# EAGLE design tiny84standalone (EAGLE 6.5.0)
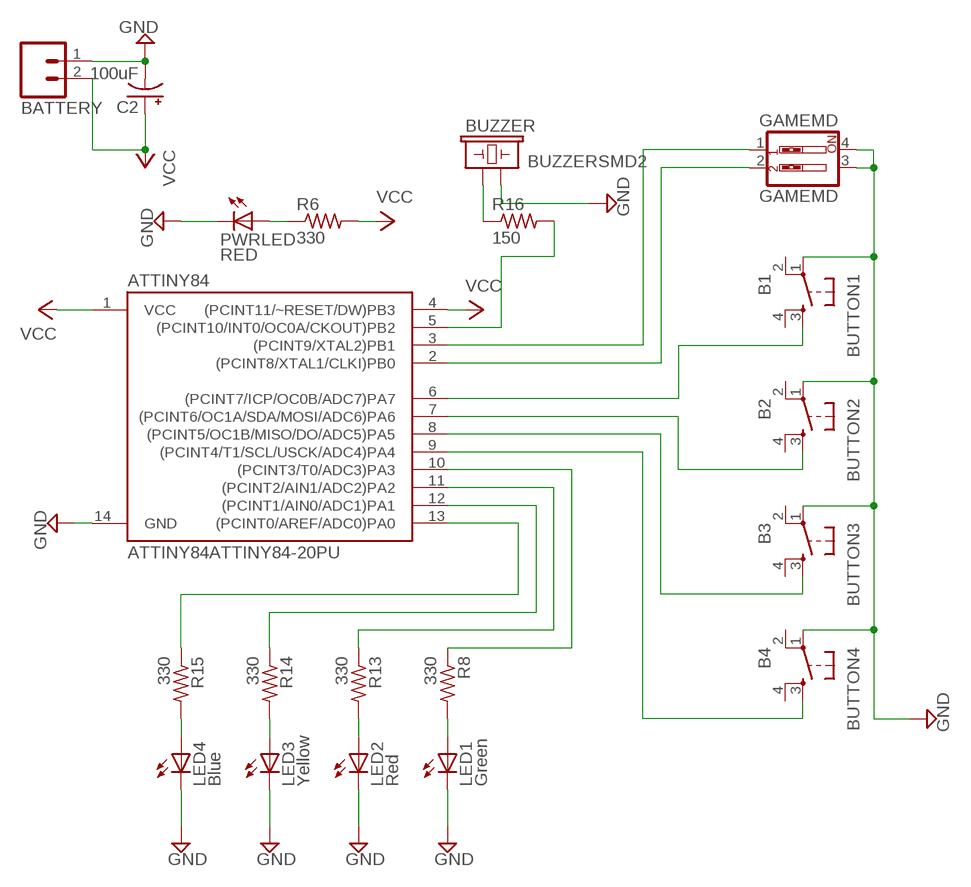
[diagram p0: schematic, sheet 1]

## Parts
ATTINY84  ATTINY84ATTINY84-20PU  [DIL14]
BATTERY  M02JST-PTH-VERT  [JST-2-PTH-VERT]
BUTTON1  B1  TAC_SWITCHPTH  [TACTILE-PTH]
BUTTON2  B2  TAC_SWITCHPTH  [TACTILE-PTH]
BUTTON3  B3  TAC_SWITCHPTH  [TACTILE-PTH]
BUTTON4  B4  TAC_SWITCHPTH  [TACTILE-PTH]
BUZZER  BUZZERSMD2  [BUZZER-CCV]
C2  100uF  CAP_POLPTH1  [CPOL-RADIAL-100UF-25V]
GAMEMD  GAMEMD  SW_DIP-2  [DIPSWITCH-02]
LED1  Green  LED5MM  [LED5MM]
LED2  Red  LED5MM  [LED5MM]
LED3  Yellow  LED5MM  [LED5MM]
LED4  Blue  LED5MM  [LED5MM]
PWRLED  RED  LEDCHIPLED_0805  [CHIPLED_0805]
R6  330  R-US_R0805  [R0805]
R8  330  R-US_R0805  [R0805]
R13  330  R-US_R0805  [R0805]
R14  330  R-US_R0805  [R0805]
R15  330  R-US_R0805  [R0805]
R16  150  R-US_R0805  [R0805]

## Nets
GND: ATTINY84.14(GND) BATTERY.1 BUTTON1.1 BUTTON2.1 BUTTON3.1 BUTTON4.1 BUZZER.- C2.2(-) GAMEMD.3 GAMEMD.4 LED1.K(C) LED2.K(C) LED3.K(C) LED4.K(C) PWRLED.C
N$1: BUZZER.+ R16.1
N$2: PWRLED.A R6.1
N$3: LED1.A R8.2
N$4: LED2.A R13.2
N$5: ATTINY84.6((PCINT7/ICP/OC0B/ADC7)PA7) BUTTON1.3
N$6: ATTINY84.5((PCINT10/INT0/OC0A/CKOUT)PB2) R16.2
N$7: LED3.A R14.2
N$8: LED4.A R15.2
N$9: ATTINY84.7((PCINT6/OC1A/SDA/MOSI/ADC6)PA6) BUTTON2.3
N$10: ATTINY84.3((PCINT9/XTAL2)PB1) GAMEMD.1
N$11: ATTINY84.2((PCINT8/XTAL1/CLKI)PB0) GAMEMD.2
N$13: ATTINY84.8((PCINT5/OC1B/MISO/DO/ADC5)PA5) BUTTON3.3
N$14: ATTINY84.9((PCINT4/T1/SCL/USCK/ADC4)PA4) BUTTON4.3
N$15: ATTINY84.10((PCINT3/T0/ADC3)PA3) R8.1
N$16: ATTINY84.11((PCINT2/AIN1/ADC2)PA2) R13.1
N$17: ATTINY84.12((PCINT1/AIN0/ADC1)PA1) R14.1
N$18: ATTINY84.13((PCINT0/AREF/ADC0)PA0) R15.1
VCC: ATTINY84.1(VCC) ATTINY84.4((PCINT11/~RESET/DW)PB3) BATTERY.2 C2.1(+) R6.2
Unconnected: BUTTON1.2 BUTTON1.4 BUTTON2.2 BUTTON2.4 BUTTON3.2 BUTTON3.4 BUTTON4.2 BUTTON4.4

## Library data of the parts
ATTINY84 = SparkFun-DigitalIC:ATTINY84: Atmel 14-pin 2/4/8kB flash uC
BATTERY = SparkFun-Connectors:M02: Standard 2-pin 0.1" header. Use with - straight break away headers ( PRT-00116) - right angle break away headers (PRT-00553) - swiss pins (PRT-00743) - machine pins (PRT-00117) - female headers (PRT-00115) Molex polarized connector foot print use with: PRT-08233 with associated crimp pins and housings. 2.54_SCREWTERM for use with PRT-10571. 3.5mm Screw Terminal footprints for PRT-08084 5mm Screw Terminal footprints for use with PRT-08433
BUTTON1-BUTTON4 = SparkFun-Electromechanical:TAC_SWITCH: Momentary Switch Button commonly used for reset or general input. Spark Fun Electronics SKU : COM-00097 SMT- SWCH-08247
BUZZER = SparkFun-Electromechanical:BUZZER: Buzzer 12mm Spark Fun Electronics SKU : Comp-Buzzer
C2 = SparkFun-Capacitors:CAP_POL: Capacitor Polarized These are standard SMD and PTH capacitors. Normally 10uF, 47uF, and 100uF in electrolytic and tantalum varieties. Always verify the external diameter of the through hole cap, it varies with capacity, voltage, and manufacturer. The EIA devices should be standard.
GAMEMD = SparkFun-Electromechanical:SW_DIP-2: DIP SWITCH
LED1-LED4 = SparkFun-LED:LED: LEDs Standard schematic elements and footprints for 5mm, 3mm, 1206, and 0603 sized LEDs. 5mm - Spark Fun Electronics SKU : COM-00529 (and others)
PWRLED = led:LED: LED OSRAM: - CHIPLED LG R971, LG N971, LY N971, LG Q971, LY Q971, LO R971, LY R971 LH N974, LH R974 LS Q976, LO Q976, LY Q976 LO Q996 - Hyper CHIPLED LW Q18S LB Q993, LB Q99A, LB R99A - SideLED LS A670, LO A670, LY A670, LG A670, LP A670 LB A673, LV A673, LT A673, LW A673 LH A674 LY A675 LS A676, LA A676, LO A676, LY A676, LW A676 LS A679, LY A679, LG A679 - Hyper Micro SIDELED® LS Y876, LA Y876, LO Y876, LY Y876 LT Y87S - SmartLED LW L88C, LW L88S LB L89C, LB L89S, LG L890 LS L89K, LO L89K, LY L89K LS L896, LA L896, LO L896, LY L896 - TOPLED LS T670, LO T670, LY T670, LG T670, LP T670 LSG T670, LSP T670, LSY T670, LOP T670, LYG T670 LG T671, LOG T671, LSG T671 LB T673, LV T673, LT T673, LW T673 LH T674 LS T676, LA T676, LO T676, LY T676, LB T676, LH T676, LSB T676, LW T676 LB T67C, LV T67C, LT T67C, LS T67K, LO T67K, LY T67K, LW E67C LS E67B, LA E67B, LO E67B, LY E67B, LB E67C, LV E67C, LT E67C LW T67C LS T679, LY T679, LG T679 LS T770, LO T770, LY T770, LG T770, LP T770 LB T773, LV T773, LT T773, LW T773 LH T774 LS E675, LA E675, LY E675, LS T675 LS T776, LA T776, LO T776, LY T776, LB T776 LHGB T686 LT T68C, LB T68C - Hyper Mini TOPLED® LB M676 - Mini TOPLED Santana® LG M470 LS M47K, LO M47K, LY M47K Source: http://www.osram.convergy.de LUXEON: - LUMILED® LXK2-PW12-R00, LXK2-PW12-S00, LXK2-PW14-U00, LXK2-PW14-V00 LXK2-PM12-R00, LXK2-PM12-S00, LXK2-PM14-U00 LXK2-PE12-Q00, LXK2-PE12-R00, LXK2-PE12-S00, LXK2-PE14-T00, LXK2-PE14-U00 LXK2-PB12-K00, LXK2-PB12-L00, LXK2-PB12-M00, LXK2-PB14-N00, LXK2-PB14-P00, LXK2-PB14-Q00 LXK2-PR12-L00, LXK2-PR12-M00, LXK2-PR14-Q00, LXK2-PR14-R00 LXK2-PD12-Q00, LXK2-PD12-R00, LXK2-PD12-S00 LXK2-PH12-R00, LXK2-PH12-S00 LXK2-PL12-P00, LXK2-PL12-Q00, LXK2-PL12-R00 Source: www.luxeon.com KINGBRIGHT: KA-3528ASYC Source: www.kingbright.com
R6 R16 = resistor:R-US_: RESISTOR, American symbol
R8 R13-R15 = rcl:R-US_: RESISTOR, American symbol

## Board
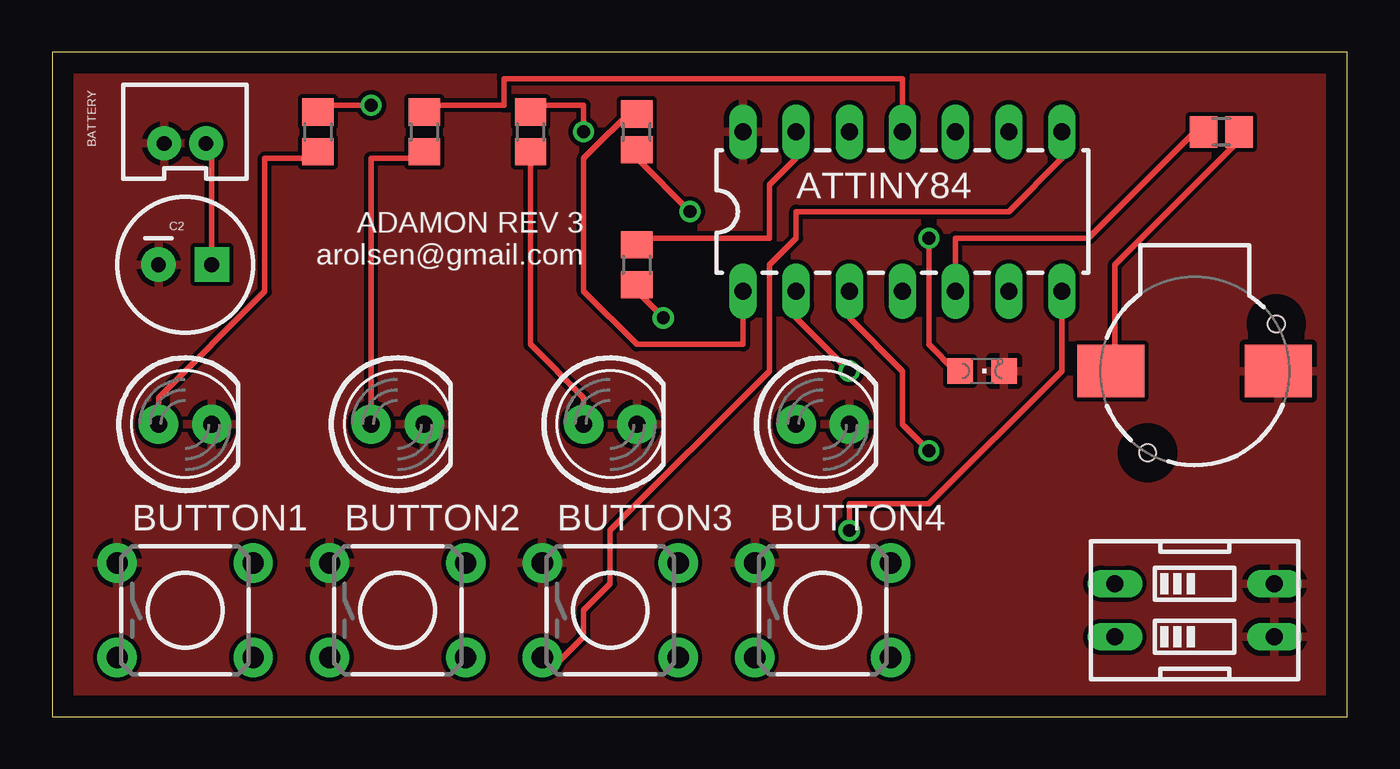
[diagram p1: board, top side]
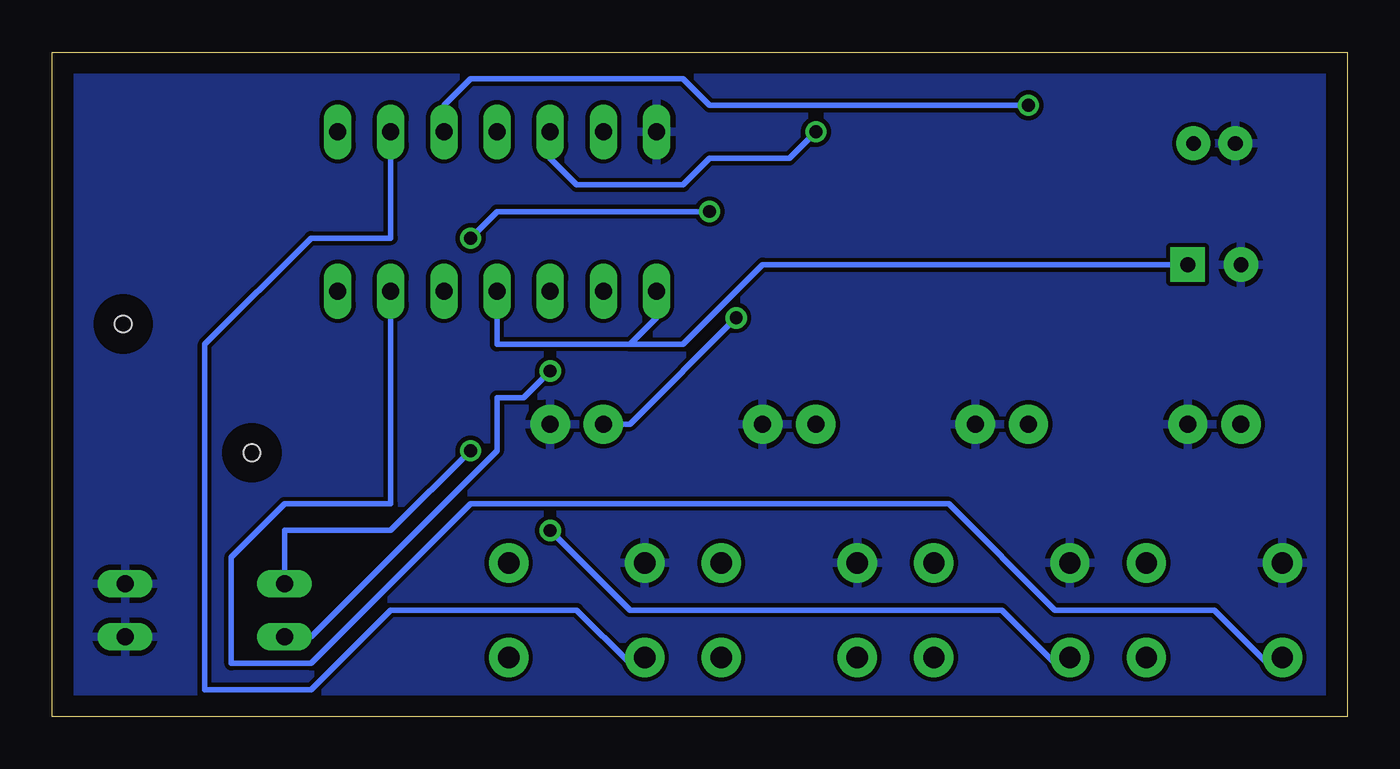
[diagram p2: board, bottom side, seen from below]

Size 61.9 x 31.74 mm. Coordinates in mm from the lower left corner, seen from the top.
Outline: 0,0 61.9,0 61.9,31.74 0,31.74 0,0
Copper layers (1*16): Top 0.035mm / dielectric 1.5mm / Bottom 0.035mm
Design rules "default": minimum track width 10mil, minimum drill 24mil, track to track 8mil, track to pad 8mil, pad to pad 8mil, via to via 8mil, smd to smd 8mil, copper to edge 40mil, drill to drill 8mil, minimum pad ring 10mil, minimum via ring 8mil, stop-mask expansion 4mil, vias tented up to drill 0mil, thermal gap 10mil

### Footprints (pad centres in the part's own frame; a part is rotated, then mirrored left to right if it is on the bottom)
DIL14 = drill 0.813 long: 1 -8.89,-3.81; 2 -6.35,-3.81; 3 -3.81,-3.81; 4 -1.27,-3.81; 5 1.27,-3.81; 6 3.81,-3.81; 7 6.35,-3.81; 8 6.35,3.81; 9 3.81,3.81; 10 1.27,3.81; 11 -1.27,3.81; 12 -3.81,3.81; 13 -6.35,3.81; 14 -8.89,3.81
JST-2-PTH-VERT = drill 0.7 pad 1.626: 1 -1,-0.55; 2 1,-0.55
TACTILE-PTH = drill 1.016 pad 1.88: 1 -3.251,2.261; 2 3.251,2.261; 3 -3.251,-2.261; 4 3.251,-2.261
BUZZER-CCV = smd 3.2 x 2.5: + 4,0; - -4,0 | hole 0.8: -3.9,-2.25; 2.25,3.9
CPOL-RADIAL-100UF-25V = drill 0.7 pad 1.651 square: 1 1.27,0 | drill 0.7 pad 1.651: 2 -1.27,0
DIPSWITCH-02 = drill 0.813 long: 1 -1.27,-3.81; 2 1.27,-3.81; 3 1.27,3.81; 4 -1.27,3.81
LED5MM = drill 0.813 pad 1.88: A -1.27,0; K 1.27,0
CHIPLED_0805 = smd 1.2 x 1.2: A 0,-1.05; C 0,1.05
R0805 = smd 1.3 x 1.5: 1 -0.85,0; 2 0.85,0
R0805' = smd 1.3 x 1.5: 1 -0.95,0; 2 0.95,0

### Placement (x,y rotation side)
ATTINY84  41.91,24.13 0 top
BATTERY  6.35,27.94 0 top
BUTTON1  6.35,5.08 0 top
BUTTON2  16.51,5.08 0 top
BUTTON3  26.67,5.08 0 top
BUTTON4  36.83,5.08 0 top
BUZZER  54.61,16.51 180 top
C2  6.35,21.59 0 top
GAMEMD  54.61,5.08 270 top
LED1  6.35,13.97 0 top
LED2  16.51,13.97 0 top
LED3  26.67,13.97 0 top
LED4  36.83,13.97 0 top
PWRLED  44.45,16.51 270 top
R6  27.94,27.94 90 top
R8  330  [R0805']  12.7,27.94 270 top
R13  330  [R0805']  17.78,27.94 270 top
R14  330  [R0805']  22.86,27.94 270 top
R15  330  [R0805']  27.94,21.59 270 top
R16  55.88,27.94 180 top

### Tracks (layer width: path | path; a pad name or v marks a point on that pad's centre or on a via)
GND
  pour Bottom: 0,31.75 0,0 62.23,0 62.23,31.75
  pour Top: 0,31.75 0,0 62.23,0 62.23,31.75
N$1
  Top 0.254: R16.1 57.15,27.94 50.8,21.59 50.8,16.51 BUZZER.+
N$2  (via drill 0.61)
  Top 0.254: v41.91,22.86 41.91,17.78 43.18,16.51 PWRLED.A | v30.48,24.13 27.94,26.67 R6.1
  Bottom 0.254: v41.91,22.86 40.64,24.13 v30.48,24.13
N$3
  Top 0.254: LED1.A 5.08,15.24 10.16,20.32 10.16,26.67 12.7,26.67 R8.2
N$4
  Top 0.254: LED2.A 15.24,26.67 17.78,26.67 R13.2
N$5
  Bottom 0.254: ATTINY84.6 45.72,10.16 50.8,10.16 53.34,7.62 53.34,2.54 49.53,2.54 41.91,10.16 19.05,10.16 13.97,5.08 6.35,5.08 3.81,2.54 BUTTON1.3
N$6
  Top 0.254: ATTINY84.5 43.18,22.86 49.53,22.86 54.61,27.94 R16.2
N$7
  Top 0.254: R14.2 22.86,17.78 25.4,15.24 LED3.A
N$8  (via drill 0.61)
  Top 0.254: v29.21,19.05 27.94,20.32 R15.2
  Bottom 0.254: v29.21,19.05 34.29,13.97 LED4.A
N$9  (via drill 0.61)
  Top 0.254: ATTINY84.7 48.26,16.51 41.91,10.16 38.1,10.16 v38.1,8.89
  Bottom 0.254: v38.1,8.89 34.29,5.08 16.51,5.08 13.97,2.54 BUTTON2.3
N$10  (via drill 0.61)
  Top 0.254: v41.91,12.7 40.64,13.97 40.64,16.51 38.1,19.05 ATTINY84.3
  Bottom 0.254: GAMEMD.1 50.8,8.89 45.72,8.89 v41.91,12.7
N$11  (via drill 0.61)
  Top 0.254: v38.1,16.51 35.56,19.05 ATTINY84.2
  Bottom 0.254: GAMEMD.2 49.53,3.81 40.64,12.7 40.64,15.24 39.37,15.24 v38.1,16.51
N$13
  Top 0.254: ATTINY84.8 48.26,26.67 45.72,24.13 35.56,24.13 35.56,22.86 34.29,21.59 34.29,16.51 26.67,8.89 26.67,6.35 25.4,5.08 25.4,3.81 24.13,2.54 BUTTON3.3
N$14
  Bottom 0.254: ATTINY84.9 45.72,22.86 49.53,22.86 54.61,17.78 54.61,1.27 49.53,1.27 45.72,5.08 36.83,5.08 34.29,2.54 BUTTON4.3
N$15  (via drill 0.61)
  Top 0.254: v15.24,29.21 12.7,29.21 R8.1
  Bottom 0.254: v15.24,29.21 30.48,29.21 31.75,30.48 41.91,30.48 43.18,29.21 ATTINY84.10
N$16
  Top 0.254: ATTINY84.11 40.64,30.48 21.59,30.48 21.59,29.21 17.78,29.21 R13.1
N$17  (via drill 0.61)
  Top 0.254: v25.4,27.94 25.4,29.21 22.86,29.21 R14.1
  Bottom 0.254: v25.4,27.94 26.67,26.67 30.48,26.67 31.75,25.4 36.83,25.4 38.1,26.67 ATTINY84.12
N$18
  Top 0.254: ATTINY84.13 35.56,26.67 34.29,25.4 34.29,22.86 27.94,22.86 R15.1
VCC
  Top 0.254: C2.1 7.62,26.67 BATTERY.2 | ATTINY84.1 33.02,17.78 27.94,17.78 25.4,20.32 25.4,26.67 27.94,29.21 R6.2
  Bottom 0.254: ATTINY84.4 40.64,17.78 34.29,17.78 | 34.29,17.78 33.02,19.05 ATTINY84.1 | C2.1 27.94,21.59 31.75,17.78 34.29,17.78

### Text on the board
tPlace: ADAMON REV 3 / arolsen@gmail.com